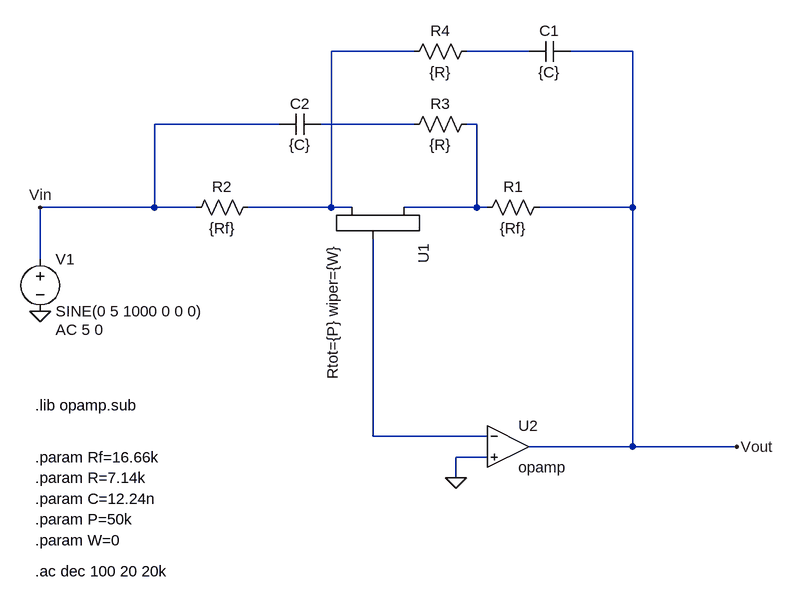
[diagram p0: schematic tilt_filter.asc]
tilt_filter.asc, the LTspice schematic file:
Version 4
SHEET 1 984 680
WIRE 416 -144 288 -144
WIRE 592 -144 496 -144
WIRE 752 -144 656 -144
WIRE 208 -32 16 -32
WIRE 416 -32 272 -32
WIRE 512 -32 496 -32
WIRE 16 96 16 -32
WIRE 16 96 -160 96
WIRE 80 96 16 96
WIRE 288 96 288 -144
WIRE 288 96 160 96
WIRE 320 96 288 96
WIRE 512 96 512 -32
WIRE 512 96 400 96
WIRE 528 96 512 96
WIRE 752 96 752 -144
WIRE 752 96 608 96
WIRE -160 176 -160 96
WIRE 352 448 352 144
WIRE 528 448 352 448
WIRE 752 464 752 96
WIRE 752 464 592 464
WIRE 912 464 752 464
WIRE 528 480 480 480
WIRE 480 512 480 480
FLAG 480 512 0
FLAG -160 256 0
FLAG -160 96 Vin
FLAG 912 464 Vout
SYMBOL potentiometer_standard 416 80 R90
SYMATTR InstName U1
SYMATTR Value Rtot={P} wiper={W}
SYMBOL OpAmps\\opamp 560 400 R0
SYMATTR InstName U2
SYMBOL res 624 80 R90
WINDOW 0 0 56 VBottom 2
WINDOW 3 32 56 VTop 2
SYMATTR InstName R1
SYMATTR Value {Rf}
SYMBOL res 176 80 R90
WINDOW 0 0 56 VBottom 2
WINDOW 3 32 56 VTop 2
SYMATTR InstName R2
SYMATTR Value {Rf}
SYMBOL res 512 -48 R90
WINDOW 0 0 56 VBottom 2
WINDOW 3 32 56 VTop 2
SYMATTR InstName R3
SYMATTR Value {R}
SYMBOL res 512 -160 R90
WINDOW 0 0 56 VBottom 2
WINDOW 3 32 56 VTop 2
SYMATTR InstName R4
SYMATTR Value {R}
SYMBOL cap 656 -160 R90
WINDOW 0 0 32 VBottom 2
WINDOW 3 32 32 VTop 2
SYMATTR InstName C1
SYMATTR Value {C}
SYMBOL cap 272 -48 R90
WINDOW 0 0 32 VBottom 2
WINDOW 3 32 32 VTop 2
SYMATTR InstName C2
SYMATTR Value {C}
SYMBOL voltage -160 160 R0
WINDOW 123 24 124 Left 2
WINDOW 39 0 0 Left 0
SYMATTR InstName V1
SYMATTR Value SINE(0 5 1000 0 0 0)
SYMATTR Value2 AC 5 0
TEXT -168 480 Left 2 !.param Rf=16.66k
TEXT -168 512 Left 2 !.param R=7.14k
TEXT -168 544 Left 2 !.param C=12.24n
TEXT -168 576 Left 2 !.param P=50k
TEXT -168 608 Left 2 !.param W=0
TEXT -168 656 Left 2 !.ac dec 100 20 20k
TEXT -168 400 Left 2 !.lib opamp.sub

The netlist it stands for:
* tilt_filter.asc
XU1 N004 N001 N005 Rtot={P} wiper={W}
XU2 N005 0 Vout opamp Aol=100K GBW=10Meg  ; pins invin noninvin out
R1 Vout N004 {Rf}
R2 N001 Vin {Rf}
R3 N004 N003 {R}
R4 N002 N001 {R}
C1 Vout N002 {C}
C2 N003 Vin {C}
V1 Vin 0 SINE(0 5 1000 0 0 0) AC 5 0
.param Rf=16.66k
.param R=7.14k
.param C=12.24n
.param P=50k
.param W=0
.ac dec 100 20 20k
.lib opamp.sub
.backanno
.end